# EAGLE design Small e-PaperShield v2.1 (EAGLE 7.2.0)
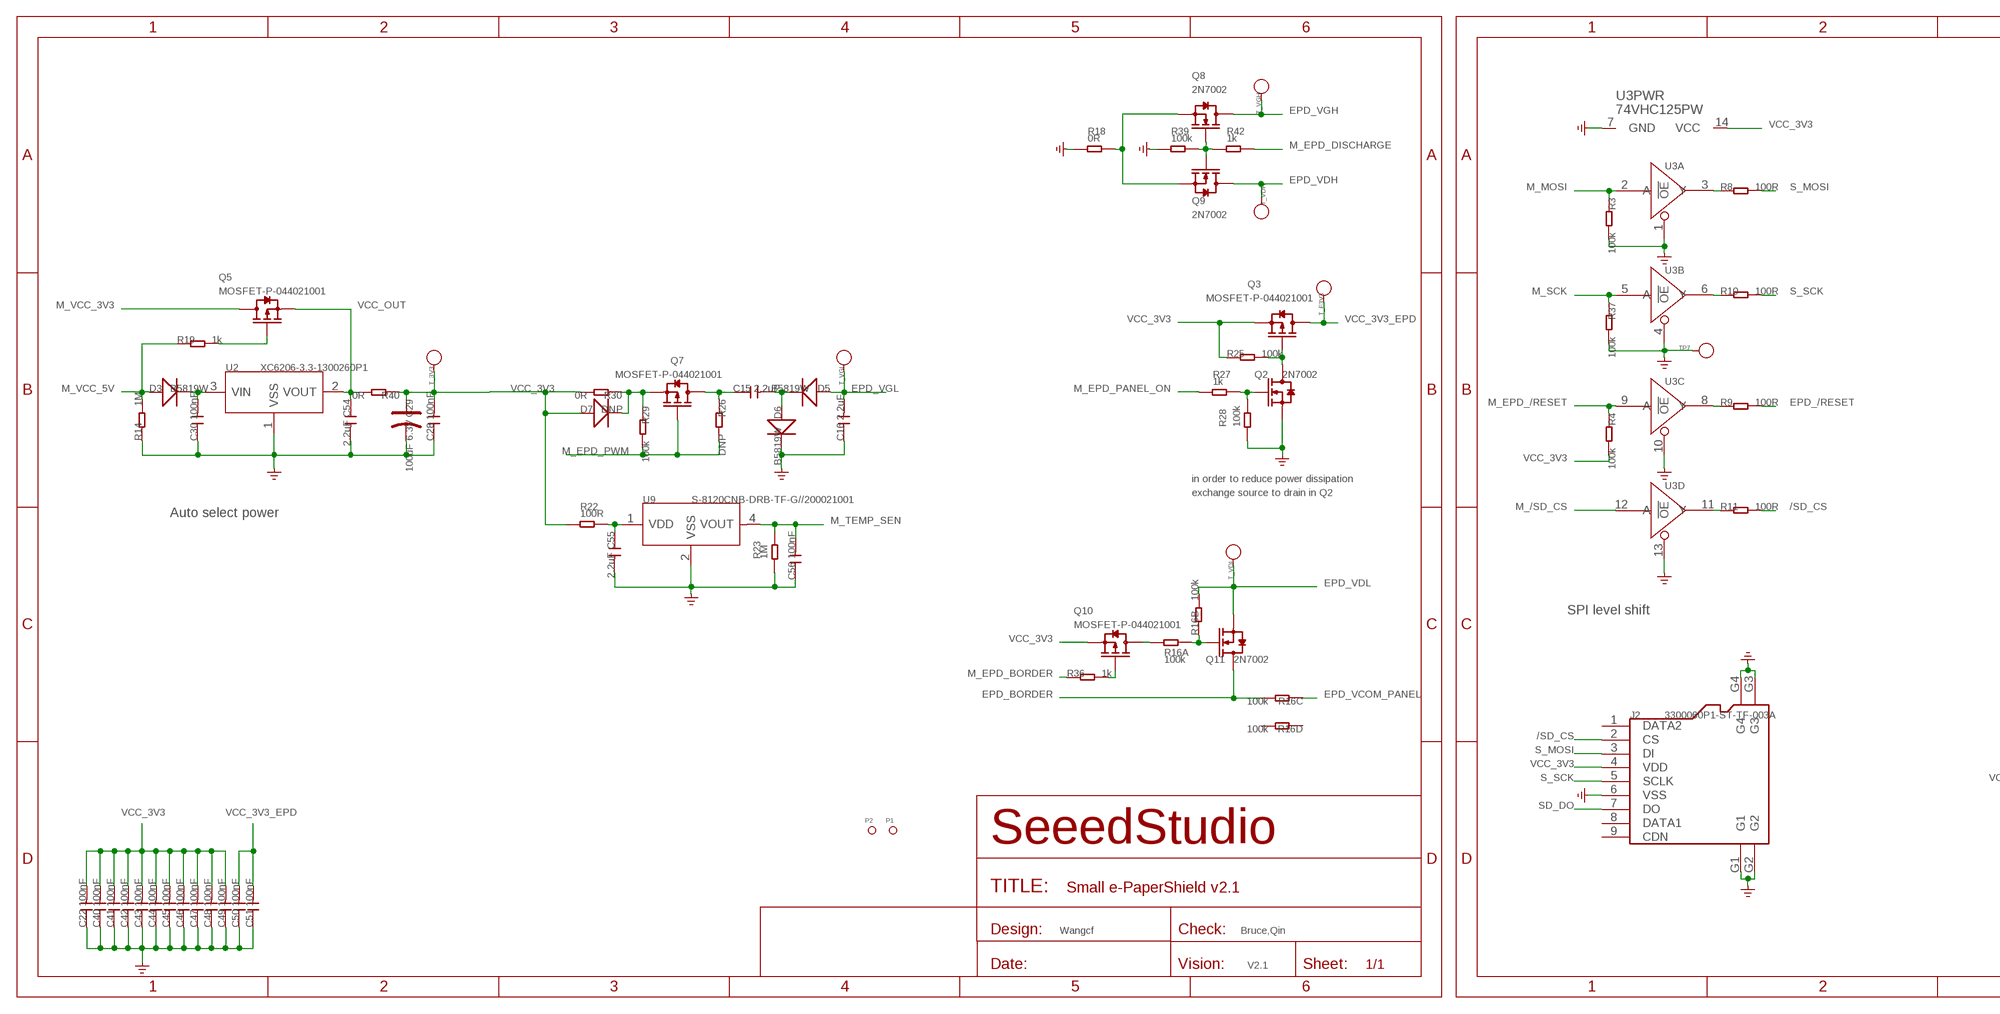
[diagram p0: schematic, sheet 1, part 1 of 2]
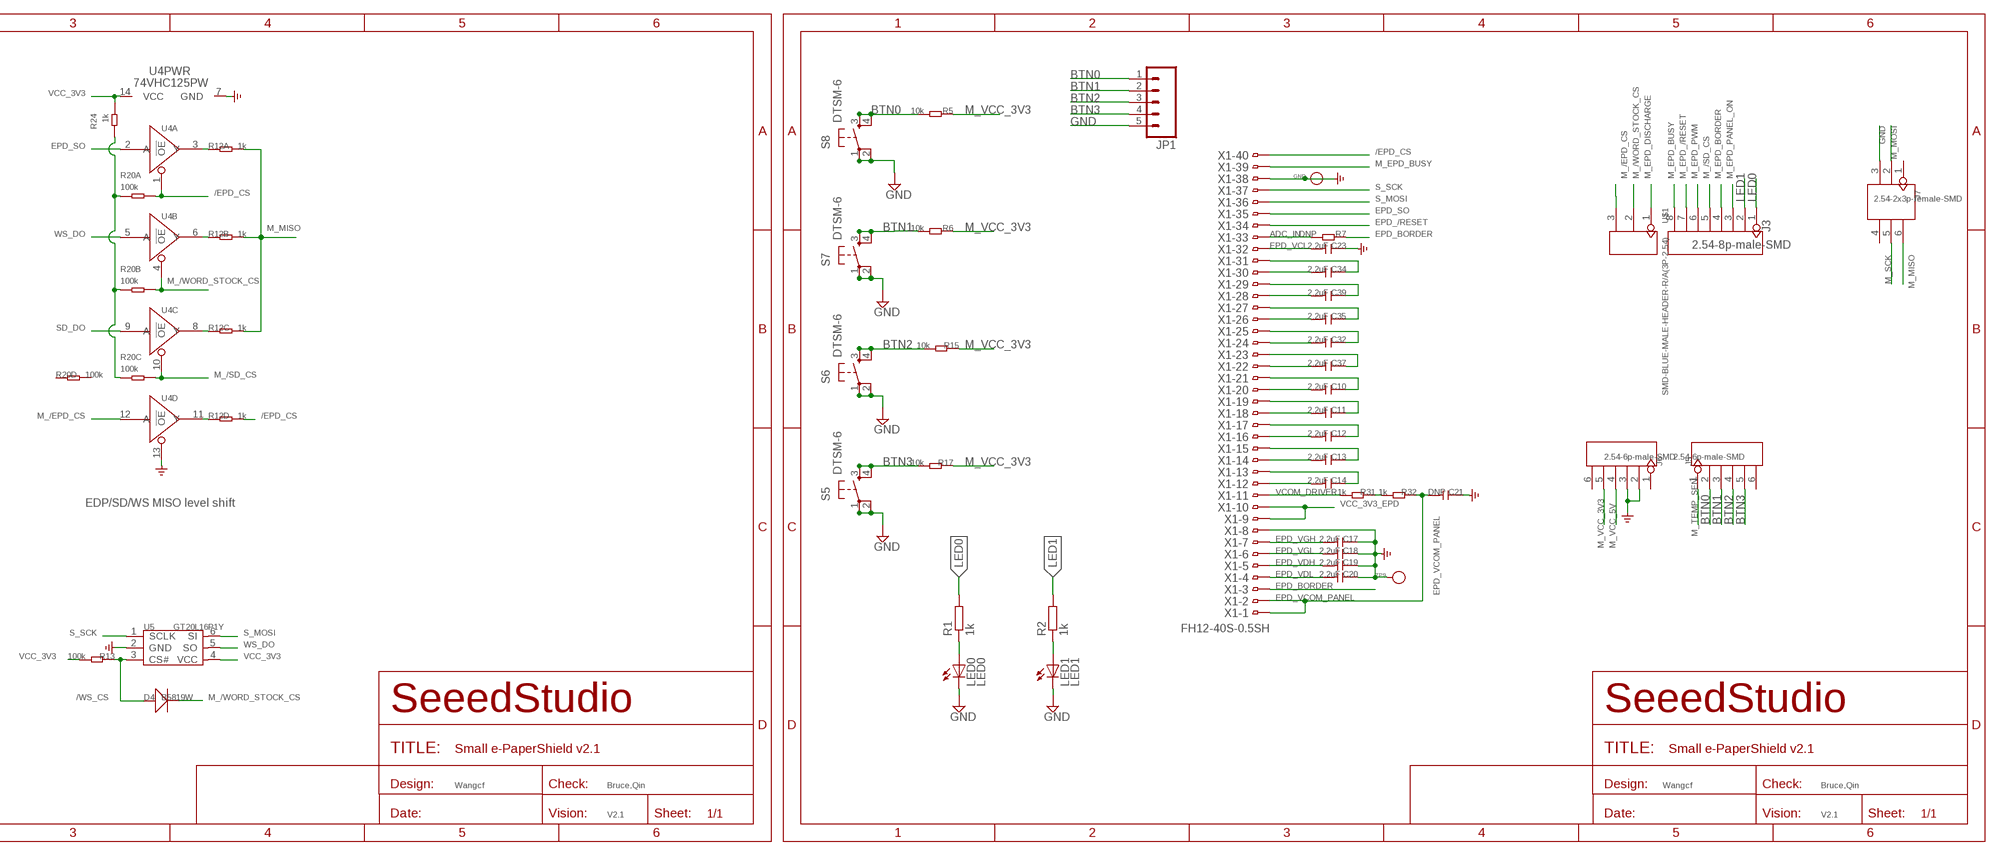
[diagram p1: schematic, sheet 1, part 2 of 2]

## Parts
C10  2.2uF  C-0805  [C0805]
C11  2.2uF  C-0805  [C0805]
C12  2.2uF  C-0805  [C0805]
C13  2.2uF  C-0805  [C0805]
C14  2.2uF  C-0805  [C0805]
C15  2.2uF  C-0805  [C0805]
C16  2.2uF  C-0805  [C0805]
C17  2.2uF  C-0805  [C0805]
C18  2.2uF  C-0805  [C0805]
C19  2.2uF  C-0805  [C0805]
C20  2.2uF  C-0805  [C0805]
C21  DNP  C-0805  [C0805]
C22  100nF  C-0603  [C0603]
C23  2.2uF  C-0805  [C0805]
C28  100nF  C-0603  [C0603]
C29  100uF 6.3V  CAP-AVX-B  [AVX-B]
C30  100nF  C-0603  [C0603]
C32  2.2uF  C-0805  [C0805]
C34  2.2uF  C-0805  [C0805]
C35  2.2uF  C-0805  [C0805]
C37  2.2uF  C-0805  [C0805]
C39  2.2uF  C-0805  [C0805]
C40  100nF  C-0603  [C0603]
C41  100nF  C-0603  [C0603]
C42  100nF  C-0603  [C0603]
C43  100nF  C-0603  [C0603]
C44  100nF  C-0603  [C0603]
C45  100nF  C-0603  [C0603]
C46  100nF  C-0603  [C0603]
C47  100nF  C-0603  [C0603]
C48  100nF  C-0603  [C0603]
C49  100nF  C-0603  [C0603]
C50  100nF  C-0603  [C0603]
C51  100nF  C-0603  [C0603]
C54  2.2uF  C-0805  [C0805]
C55  2.2uF  C-0805  [C0805]
C56  100nF  C-0603  [C0603]
D3  B5819W  D'1206'  [SOD123]
D4  B5819W  D'1206'  [SOD123]
D5  B5819W  D'1206'  [SOD123]
D6  B5819W  D'1206'  [SOD123]
D7  DNP  D'1206'  [SOD123]
GND  PAD-TEST-POINT'3535'  [TP_3535]
J2  3300060P1-ST-TF-003A  [9P-SMD-W/-RING]
J3  2.54-8p-male-SMD  HEADER-8P-2.54-SMD  [8P-2.54-SMD]
J5  2.54-6p-male-SMD  HEADER-6P-SMD  [6P-2.54-SMD]
J6  2.54-6p-male-SMD  HEADER-6P-SMD  [6P-2.54-SMD]
J7  2.54-2x3p-female-SMD  HEADER-2X3P-SMD  [2X3P-2.54-SMD]
JP1  M05PTH_LONGPADS  [1X05_LONGPADS]
LED0  LED0  LEDCHIPLED_0603  [CHIPLED_0603]
LED1  LED1  LEDCHIPLED_0603  [CHIPLED_0603]
P1  PAD-MARK  [ROUND-MARK-1.0]
P2  PAD-MARK  [ROUND-MARK-1.0]
Q2  2N7002  MOSFET-N'SOT23'  [SOT23]
Q3  MOSFET-P-044021001  [SOT23]
Q5  MOSFET-P-044021001  [SOT23]
Q7  MOSFET-P-044021001  [SOT23]
Q8  2N7002  MOSFET-N'SOT23'  [SOT23]
Q9  2N7002  MOSFET-N'SOT23'  [SOT23]
Q10  MOSFET-P-044021001  [SOT23]
Q11  2N7002  MOSFET-N'SOT23'  [SOT23]
R1  1k  R-EU_R0603  [R0603]
R2  1k  R-EU_R0603  [R0603]
R3  100k  R-0603  [R0603]
R4  100k  R-0603  [R0603]
R5  10k  R-0603  [R0603]
R6  10k  R-0603  [R0603]
R7  DNP  R-0603  [R0603]
R8  100R  R-0603  [R0603]
R9  100R  R-0603  [R0603]
R10  100R  R-0603  [R0603]
R11  100R  R-0603  [R0603]
R12  1k  R-4R-1206  [1206-8-3.3X2.4]
R13  100k  R-0603  [R0603]
R14  1M  R-0603  [R0603]
R15  10k  R-0603  [R0603]
R16  100k  R-4R-1206  [1206-8-3.3X2.4]
R17  10k  R-0603  [R0603]
R18  0R  R-0603  [R0603]
R19  1k  R-0603  [R0603]
R20  100k  R-4R-1206  [1206-8-3.3X2.4]
R22  100R  R-0603  [R0603]
R23  1M  R-0603  [R0603]
R24  1k  R-0603  [R0603]
R25  100k  R-0603  [R0603]
R26  DNP  R-0603  [R0603]
R27  1k  R-0603  [R0603]
R28  100k  R-0603  [R0603]
R29  100k  R-0603  [R0603]
R30  0R  R-0603  [R0603]
R31  1k  R-0603  [R0603]
R32  1k  R-0603  [R0603]
R36  1k  R-0603  [R0603]
R37  100k  R-0603  [R0603]
R39  100k  R-0603  [R0603]
R40  0R  R-0603  [R0603]
R42  1k  R-0603  [R0603]
S5  DTSM-6  [DTSM-6]
S6  DTSM-6  [DTSM-6]
S7  DTSM-6  [DTSM-6]
S8  DTSM-6  [DTSM-6]
T_3V3  PAD-TEST-POINT'3535'  [TP_3535]
T_E3V3  PAD-TEST-POINT'3535'  [TP_3535]
T_VDH  PAD-TEST-POINT'3535'  [TP_3535]
T_VDL  PAD-TEST-POINT'3535'  [TP_3535]
T_VGH  PAD-TEST-POINT'3535'  [TP_3535]
T_VGL  PAD-TEST-POINT'3535'  [TP_3535]
TP7  PAD-TEST-POINT'3535'  [TP_3535]
TP9  PAD-TEST-POINT'3535'  [TP_3535]
U2  XC6206-3.3-1300260P1  [SOT23]
U3  74VHC125PW  [TSSOP14]
U4  74VHC125PW  [TSSOP14]
U5  GT20L16P1Y  [SOT23-6]
U9  S-8120CNB-DRB-TF-G//200021001  S-8110C/8120C  [SC-82AB]
U$1  SMD-BLUE-MALE-HEADER-R/A(3P-2.54)  [H3-SMD-2.54]
X1  FH12-40S-0.5SH  [FH12-40S-0.5SH]

## Nets
3V3_LOG: R20.1 R20.2 R20.3 R24.2
/EPD_CS: R12.5 R20.8 U4.1(A:!OE) X1.40
/SD_CS: J2.2(CS) R11.2
/WS_CS: D4.+ R13.1 U5.3(CS#)
ADC_IN: R7.2 X1.33
BTN0: J5.2 JP1.1 R5.2 S8.3 S8.4
BTN1: J5.3 JP1.2 R6.2 S7.3 S7.4
BTN2: J5.4 JP1.3 R15.2 S6.3 S6.4
BTN3: J5.5 JP1.4 R17.2 S5.3 S5.4
EPD_/RESET: R9.2 X1.34
EPD_BORDER: Q11.3(D) R7.1 R16.6 X1.3
EPD_SO: U4.2(A:A) X1.35
EPD_VCL: C23.2 X1.32
EPD_VCOM_PANEL: C21.2 R16.3 R32.1 X1.1 X1.2
EPD_VDH: C19.2 Q9.3(D) T_VDH.T X1.5
EPD_VDL: C20.2 Q11.2(S) R16.7 T_VDL.T X1.4
EPD_VGH: C17.2 Q8.3(D) T_VGH.T X1.7
EPD_VGL: C16.2 C18.2 D5.+ T_VGL.T X1.6
GND: C16.1 C17.1 C18.1 C19.1 C20.1 C21.1 C22.1 C23.1 C28.1 C29.- C30.1 C40.1 C41.1 C42.1 C43.1 C44.1 C45.1 C46.1 C47.1 C48.1 C49.1 C50.1 C51.1 C54.2 C55.2 C56.1 D6.- GND.T J2.6(VSS) J2.G1 J2.G2 J2.G3 J2.G4 J6.2 J6.3 J7.3 JP1.5 LED0.C LED1.C Q2.2(S) R3.2 R14.1 R18.1 R23.1 R28.1 R37.2 R39.1 S5.1 S5.2 S6.1 S6.2 S7.1 S7.2 S8.1 S8.2 TP7.T TP9.T U2.1(VSS) U3.1(A:!OE) U3.4(B:!OE) U3.7(PWR:GND) U3.10(C:!OE) U3.13(D:!OE) U4.7(PWR:GND) U4.13(D:!OE) U5.2(GND) U9.2(VSS) X1.8 X1.38
LED0: J3.1 R1.2
LED1: J3.2 R2.2
M_/EPD_CS: U4.12(D:A) U$1.3
M_/SD_CS: J3.5 R20.6 U3.12(D:A) U4.10(C:!OE)
M_/WORD_STOCK_CS: D4.- R20.7 U4.4(B:!OE) U$1.2
M_EPD_/RESET: J3.7 R4.1 U3.9(C:A)
M_EPD_BORDER: J3.4 R36.1
M_EPD_BUSY: J3.8 X1.39
M_EPD_DISCHARGE: R42.2 U$1.1
M_EPD_PANEL_ON: J3.3 R27.1
M_EPD_PWM: J3.6 Q7.1(G) R26.2 R29.2
M_MISO: J7.6 R12.6 R12.7 R12.8
M_MOSI: J7.2 R3.1 U3.2(A:A)
M_SCK: J7.5 R37.1 U3.5(B:A)
M_TEMP_SEN: C56.2 J5.1 R23.2 U9.4(VOUT)
M_VCC_3V3: J6.5 Q5.3(D) R5.1 R6.1 R15.1 R17.1
M_VCC_5V: D3.+ J6.4 R14.2 R19.1
N$1: LED0.A R1.1
N$2: Q5.1(G) R19.2
N$3: C15.2 D5.- D6.+
N$4: D7.- Q7.2(S) R29.1 R30.1
N$6: Q2.1(G) R27.2 R28.2
N$7: R11.1 U3.11(D:Y)
N$8: C30.2 D3.- U2.3(VIN)
N$9: C15.1 Q7.3(D) R26.1
N$10: Q8.1(G) Q9.1(G) R39.2 R42.1
N$11: Q2.3(D) Q3.1(G) R25.2
N$12: R31.1 R32.2
N$13: Q10.3(D) R16.1
N$14: Q10.1(G) R36.2
N$16: Q8.2(S) Q9.2(S) R18.2
N$17: LED1.A R2.1
N$20: R12.1 U4.3(A:Y)
N$21: R12.2 U4.6(B:Y)
N$22: R12.3 U4.8(C:Y)
N$27: R12.4 U4.11(D:Y)
N$28: Q11.1(G) R16.2 R16.8
N$34: C34.1 X1.31
N$35: C34.2 X1.30
N$36: C39.1 X1.29
N$37: C39.2 X1.28
N$74: R8.1 U3.3(A:Y)
N$76: R10.1 U3.6(B:Y)
N$80: R9.1 U3.8(C:Y)
N$81: C35.1 X1.27
N$85: C35.2 X1.26
N$88: C32.1 X1.25
N$89: C32.2 X1.24
N$90: C37.1 X1.23
N$91: C37.2 X1.22
N$92: C10.1 X1.21
N$93: C10.2 X1.20
N$94: C11.1 X1.19
N$95: C11.2 X1.18
N$96: C12.1 X1.17
N$97: C12.2 X1.16
N$98: C13.1 X1.15
N$99: C13.2 X1.14
N$100: C14.1 X1.13
N$101: C14.2 X1.12
S_MOSI: J2.3(DI) R8.2 U5.6(SI) X1.36
S_SCK: J2.5(SCLK) R10.2 U5.1(SCLK) X1.37
SD_DO: J2.7(DO) U4.9(C:A)
VCC_3V3: C22.2 C28.2 C29.+ C40.2 C41.2 C42.2 C43.2 C44.2 C45.2 C46.2 C47.2 C48.2 C49.2 D7.+ J2.4(VDD) Q3.2(S) Q10.2(S) R4.2 R13.2 R22.1 R24.1 R25.1 R30.2 R40.1 T_3V3.T U3.14(PWR:VCC) U4.14(PWR:VCC) U5.4(VCC)
VCC_3V3_EPD: C50.2 C51.2 Q3.3(D) T_E3V3.T X1.9 X1.10
VCC_OUT: C54.1 Q5.2(S) R40.2 U2.2(VOUT)
VCOM_DRIVER: R31.2 X1.11
VDD: C55.1 R22.2 U9.1(VDD)
WS_DO: U4.5(B:A) U5.5(SO)
Unconnected: J2.1(DATA2) J2.8(DATA1) J2.9(CDN) J5.6 J6.1 J6.6 J7.1 J7.4 R16.4 R16.5 R20.4 R20.5

## Notes on the sheet
- in order to reduce power dissipation
- exchange source to drain in Q2
- Auto select power
- EDP/SD/WS MISO level shift
- SPI level shift
- Wangcf | Bruce,Qin | Wangcf | Bruce,Qin | Wangcf | Bruce,Qin
- V2.1 | V2.1 | V2.1

## Library data of the parts
C10-C23 C28 C30 C32 C34 C35 C37 C39-C51 C54-C56 = Discrete:C*: Ceramic Capacitors
C29 = Discrete:CAP*: Electrolytic Capacitors,Tantalum Capacitors and Super Capacitors
D3-D7 = Discrete:D*
GND T_3V3 T_E3V3 T_VDH T_VDL T_VGH T_VGL TP7 TP9 = Discrete:PAD-TEST-POINT; PARTNO: DNP
J2 = OPL-NEW:3300060P1-ST-TF-003A: Micro SD Card
J3 = Connector:HEADER-8P
J5 J6 = Connector:HEADER-6P
J7 = Connector:HEADER-2X3P
JP1 = SparkFun-Connectors:M05: Header 5 Standard 5-pin 0.1" header. Use with straight break away headers (SKU : PRT-00116), right angle break away headers (PRT-00553), swiss pins (PRT-00743), machine pins (PRT-00117), and female headers (PRT-00115). Molex polarized connector foot print use with SKU : PRT-08230 with associated crimp pins and housings.
LED0 LED1 = adafruit:LED: LED OSRAM: - CHIPLED LG R971, LG N971, LY N971, LG Q971, LY Q971, LO R971, LY R971 LH N974, LH R974 LS Q976, LO Q976, LY Q976 LO Q996 - Hyper CHIPLED LW Q18S LB Q993, LB Q99A, LB R99A - SideLED LS A670, LO A670, LY A670, LG A670, LP A670 LB A673, LV A673, LT A673, LW A673 LH A674 LY A675 LS A676, LA A676, LO A676, LY A676, LW A676 LS A679, LY A679, LG A679 - Hyper Micro SIDELED® LS Y876, LA Y876, LO Y876, LY Y876 LT Y87S - SmartLED LW L88C, LW L88S LB L89C, LB L89S, LG L890 LS L89K, LO L89K, LY L89K LS L896, LA L896, LO L896, LY L896 - TOPLED LS T670, LO T670, LY T670, LG T670, LP T670 LSG T670, LSP T670, LSY T670, LOP T670, LYG T670 LG T671, LOG T671, LSG T671 LB T673, LV T673, LT T673, LW T673 LH T674 LS T676, LA T676, LO T676, LY T676, LB T676, LH T676, LSB T676, LW T676 LB T67C, LV T67C, LT T67C, LS T67K, LO T67K, LY T67K, LW E67C LS E67B, LA E67B, LO E67B, LY E67B, LB E67C, LV E67C, LT E67C LW T67C LS T679, LY T679, LG T679 LS T770, LO T770, LY T770, LG T770, LP T770 LB T773, LV T773, LT T773, LW T773 LH T774 LS E675, LA E675, LY E675, LS T675 LS T776, LA T776, LO T776, LY T776, LB T776 LHGB T686 LT T68C, LB T68C - Hyper Mini TOPLED® LB M676 - Mini TOPLED Santana® LG M470 LS M47K, LO M47K, LY M47K Source: http://www.osram.convergy.de/
P1 P2 = Discrete:PAD-MARK; PARTNO: DNP
Q2 Q8 Q9 Q11 = Discrete:MOSFET-N: IRLL014: http://www.vishay.com/docs/91319/sihll014.pdf
Q3 Q5 Q7 Q10 = OPL:MOSFET-P: CJ2305：SMD MOSFET P-CH 8V-4.1A
R1 R2 = rcl:R-EU_: RESISTOR, European symbol
R3-R11 R13-R15 R17-R19 R22-R32 R36 R37 R39 R40 R42 = Discrete:R*
R12 R16 R20 = Discrete:R-4R*: Resistor Array
S5-S8 = switch-tact:DTSM-6
U2 = OPL:XC6206-3.3: LOW ESR Cap.Compatible Positive Voltage Regulators
U3 U4 = IC:74V*125: Quad Buffer/Line Driver;3-state
U5 = template:GT20L16P1Y
U9 = template:S-8110C/8120C: COMS Temperature Sensor IC
U$1 = Seeed-OPL-Connector:SMD-BLUE-MALE-HEADER-R/A(3P-2.54)
X1 = con-hirose:FH12-40S-0.5S: 0.5mm Pitch Connectors For FPC/FFC Source: Data sheet <http://www.hirose.co.jp/cataloge_hp/e58605370.pdf>; MPN: FH12-40S-0.5SH(55); OC_FARNELL: 1324556; OC_NEWARK: 34M6178

## Net classes
0 default: width 0.203 mm, drill 0.305 mm, clearance 0.152 mm
1 power: width 0.305 mm, drill 0.305 mm, clearance 0.152 mm

## Board
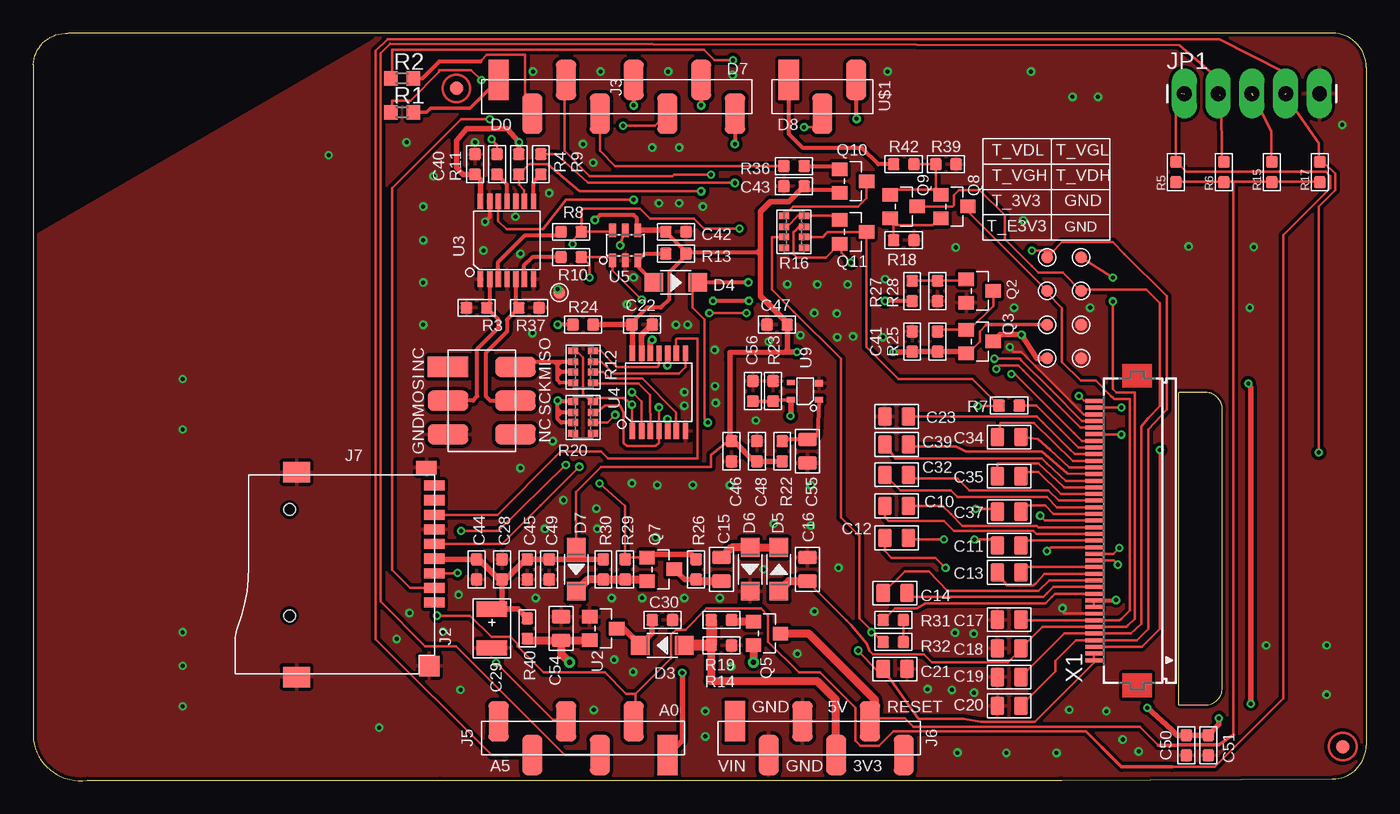
[diagram p2: board, top side]
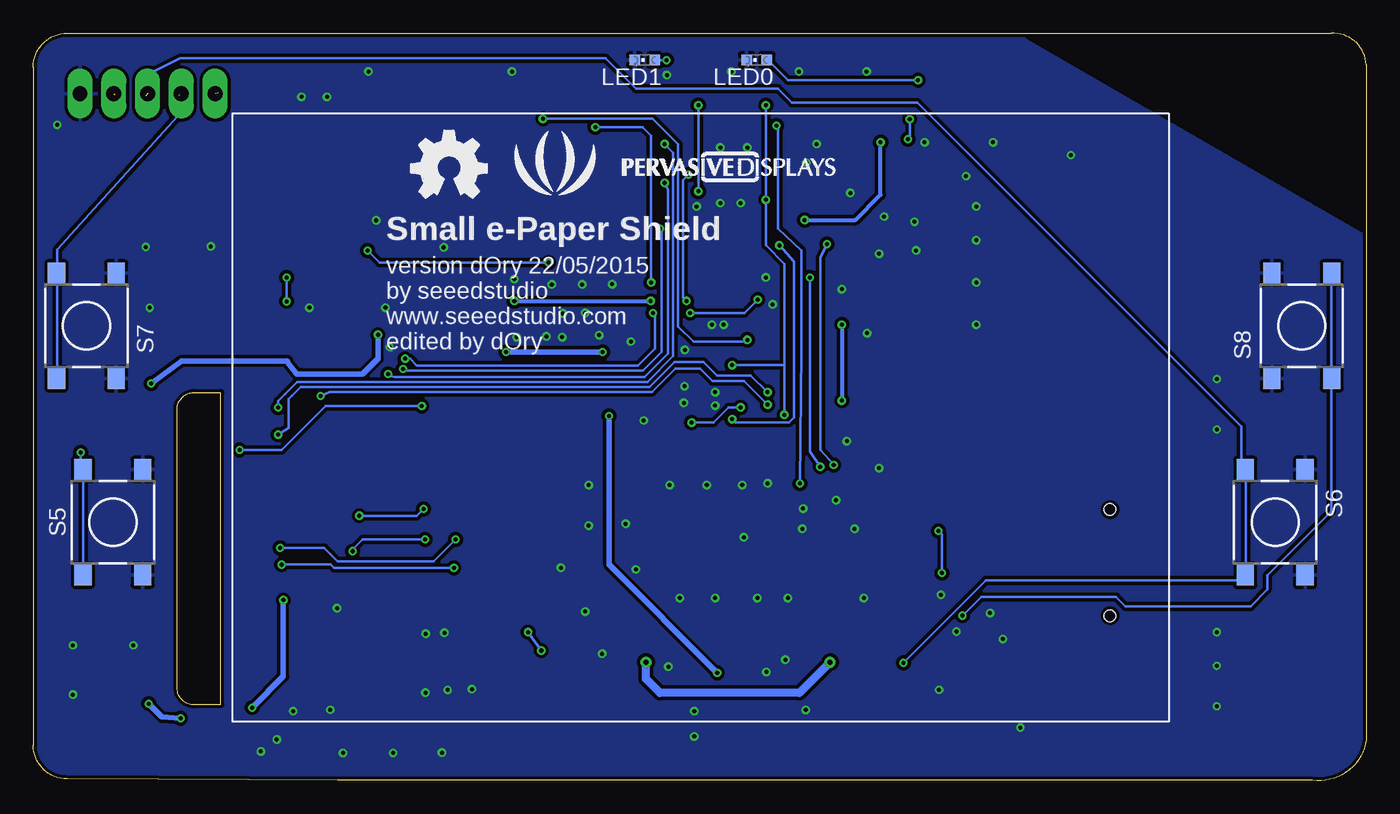
[diagram p3: board, bottom side, seen from below]

Size 100.28 x 56.24 mm. Coordinates in mm from the lower left corner, seen from the top.
Outline: 77.19,0.03 30.57,0.03 4.06,0.03 arc-90 0,3.08 0,53.86 arc-90 2.62,56.24 97.74,56.24 arc-90 100.28,53.7 100.28,2.67 arc-90 97.74,0.13 77.19,0.03
Outline: 77.19,0.03 77.4,0.03
Outline: 86.16,5.71 86.16,29.21 88.2,29.21 arc-90 89.45,27.93 89.45,6.97 arc-90 88.19,5.7 86.16,5.71
Copper layers (1*16): Top 0.035mm / dielectric 1.5mm / Bottom 0.035mm
Design rules "SeeedStudio_rule_no_angle_090911 *": minimum track width 6mil, minimum drill 12mil, track to track 6mil, track to pad 6mil, pad to pad 6mil, via to via 6mil, smd to smd 0mil, copper to edge 10mil, drill to drill 10mil, minimum pad ring 10mil, minimum via ring 6mil, stop-mask expansion 2mil, vias tented up to drill 100mil, thermal gap 10mil
tRestrict: area -3.4,39.7 to 25.2,56.3
bRestrict: area -3.4,39.7 to 25.2,56.3

### Footprints (pad centres in the part's own frame; a part is rotated, then mirrored left to right if it is on the bottom)
C0805 = smd 1.016 x 1.397: 1 -0.889,0; 2 0.889,0
C0603 = smd 0.889 x 0.889: 1 -0.762,0; 2 0.762,0
AVX-B = smd 1.143 x 2.286: + -1.46,0; - 1.46,0
SOD123 = smd 1.397 x 1.397: + -1.651,0; - 1.651,0
TP_3535 = smd 0.889 x 0.889: T 0,0
9P-SMD-W/-RING = smd 1.524 x 0.762: 1 0,4.4; 2 0,3.3; 3 0,2.2; 4 0,1.1; 5 0,0; 6 0,-1.1; 7 0,-2.2; 8 0,-3.3; 9 0,-4.4 | smd 1.524 x 1.016: G1 0.6,-5.746 | smd 2.032 x 1.524: G2 10.373,-5.4; G3 10.373,10 | smd 1.524 x 1.524: G4 0.392,9.181 | hole 0.889: 10.9,-2.6; 10.9,5.4
8P-2.54-SMD = smd 3.048 x 1.524: 1 1.27,8.89; 2 -1.27,6.35; 3 1.27,3.81; 4 -1.27,1.27; 5 1.27,-1.27; 6 -1.27,-3.81; 7 1.27,-6.35; 8 -1.27,-8.89
6P-2.54-SMD = smd 3.048 x 1.524: 1 1.27,6.35; 2 -1.27,3.81; 3 1.27,1.27; 4 -1.27,-1.27; 5 1.27,-3.81; 6 -1.27,-6.35
2X3P-2.54-SMD = smd 3.048 x 1.524: 1 -2.54,2.54; 2 -2.54,0; 3 -2.54,-2.54; 4 2.54,-2.54; 5 2.54,0; 6 2.54,2.54
1X05_LONGPADS = drill 1.118 pad 1.88 long: 1 0,0; 2 2.54,0; 3 5.08,0; 4 7.62,0; 5 10.16,0
CHIPLED_0603 = smd 0.8 x 0.8: A 0,-0.75; C 0,0.75
ROUND-MARK-1.0 = smd 1.016 x 1.016: P$1 0,0
SOT23 = smd 1.016 x 1.143: 1 -0.889,-1.016; 2 0.889,-1.016; 3 0,1.016
R0603 = smd 1 x 1.1: 1 -0.85,0; 2 0.85,0
R0603' = smd 0.889 x 0.889: 1 -0.762,0; 2 0.762,0
1206-8-3.3X2.4 = smd 0.508 x 0.762: 1 -1.206,-0.762; 2 -0.381,-0.762; 3 0.381,-0.762; 4 1.206,-0.762; 5 1.206,0.762; 6 0.381,0.762; 7 -0.381,0.762; 8 -1.206,0.762
DTSM-6 = smd 1.55 x 1.3: 1 -3.975,2.25; 2 3.975,2.25; 3 -3.975,-2.25; 4 3.975,-2.25
TSSOP14 = smd 0.4 x 1.2: 1 -2,-2.925; 2 -1.3,-2.925; 3 -0.65,-2.925; 4 0,-2.925; 5 0.65,-2.925; 6 1.3,-2.925; 7 2,-2.925; 8 2,2.925; 9 1.3,2.925; 10 0.65,2.925; 11 0,2.925; 12 -0.65,2.925; 13 -1.3,2.925; 14 -2,2.925
SOT23-6 = smd 0.508 x 1.016: 1 -0.95,-1.143; 2 0,-1.143; 3 0.95,-1.143; 4 0.95,1.143; 5 0,1.143; 6 -0.95,1.143
SC-82AB = smd 0.4 x 0.6: 1 -0.65,-1.05; 3 0.65,1.05; 4 -0.65,1.05 | smd 0.5 x 0.6: 2 0.6,-1.05
H3-SMD-2.54 = smd 3.048 x 1.524: 1 1.27,6.35; 2 -1.27,3.81; 3 1.27,1.27
FH12-40S-0.5SH = smd 0.3 x 1.3: 1 -9.75,3.25; 2 -9.25,3.25; 3 -8.75,3.25; 4 -8.25,3.25; 5 -7.75,3.25; 6 -7.25,3.25; 7 -6.75,3.25; 8 -6.25,3.25; 9 -5.75,3.25; 10 -5.25,3.25; 11 -4.75,3.25; 12 -4.25,3.25; 13 -3.75,3.25; 14 -3.25,3.25; 15 -2.75,3.25; 16 -2.25,3.25; 17 -1.75,3.25; 18 -1.25,3.25; 19 -0.75,3.25; 20 -0.25,3.25; 21 0.25,3.25; 22 0.75,3.25; 23 1.25,3.25; 24 1.75,3.25; 25 2.25,3.25; 26 2.75,3.25; 27 3.25,3.25; 28 3.75,3.25; 29 4.25,3.25; 30 4.75,3.25; 31 5.25,3.25; 32 5.75,3.25; 33 6.25,3.25; 34 6.75,3.25; 35 7.25,3.25; 36 7.75,3.25; 37 8.25,3.25; 38 8.75,3.25; 39 9.25,3.25; 40 9.75,3.25

### Placement (x,y rotation side)
C10  64.95,20.67 180 top
C11  73.41,17.7 180 top
C12  64.95,18.26 180 top
C13  73.41,15.67 180 top
C14  64.83,14.12 0 top
C15  51.77,15.9 90 top
C16  58.25,15.9 270 top
C17  73.41,12.11 0 top
C18  73.41,9.95 0 top
C19  73.41,7.8 0 top
C20  73.41,5.64 0 top
C21  64.83,8.41 180 top
C22  45.8,34.31 180 top
C23  64.95,27.4 0 top
C28  35.26,15.9 270 top
C29  34.5,11.45 270 top
C30  47.33,12.09 180 top
C32  64.95,23.01 180 top
C34  73.41,25.85 0 top
C35  73.41,22.91 0 top
C37  73.41,20.24 180 top
C39  64.95,25.3 180 top
C40  33.23,46.38 270 top
C41  66.12,33.04 270 top
C42  48.34,41.3 180 top
C43  57.23,44.73 0 top
C44  33.36,15.9 90 top
C45  37.17,15.9 90 top
C46  52.53,24.79 90 top
C47  55.96,34.31 0 top
C48  54.44,24.79 270 top
C49  38.82,15.9 90 top
C50  86.75,2.66 90 top
C51  88.4,2.66 90 top
C54  39.71,11.45 90 top
C55  58.25,24.79 270 top
C56  54.13,29.31 270 top
D3  47.33,10.18 180 top
D4  48.34,37.49 0 top
D5  56.09,15.9 90 top
D6  53.93,15.9 270 top
D7  40.85,15.9 270 top
GND  78.82,31.77 0 top
J2  30.18,17.8 180 top
J3  43.9,51.46 90 top
J5  41.36,3.2 270 top
J6  59.14,3.2 90 top
J7  33.74,28.6 0 top
JP1  86.6,51.69 0 top
LED0  45.86,54.23 90 bottom
LED1  54.28,54.22 90 bottom
P1  31.83,52.09 0 top
P2  98.51,2.56 0 top
Q2  71.2,36.85 270 top
Q3  71.2,33.04 270 top
Q5  55.2,11.07 270 top
Q7  47.2,15.9 270 top
Q8  69.3,43.2 270 top
Q9  65.49,43.2 270 top
Q10  61.68,45.11 270 top
Q11  61.68,41.3 270 top
R1  27.74,50.29 0 top
R2  27.74,52.83 0 top
R3  100k  [R0603']  33.36,35.58 180 top
R4  100k  [R0603']  36.53,46.38 90 top
R5  10k  [R0603']  85.96,45.79 90 top
R6  10k  [R0603']  89.57,45.79 90 top
R7  DNP  [R0603']  73.41,28.22 0 top
R8  100R  [R0603']  40.47,41.3 0 top
R9  100R  [R0603']  38.18,46.38 90 top
R10  100R  [R0603']  40.47,39.39 0 top
R11  100R  [R0603']  34.88,46.38 90 top
R12  41.36,31.14 90 top
R13  100k  [R0603']  48.34,39.65 0 top
R14  1M  [R0603']  51.77,10.18 180 top
R15  10k  [R0603']  93.17,45.79 90 top
R16  57.23,41.3 270 top
R17  10k  [R0603']  96.78,45.79 90 top
R18  0R  [R0603']  65.49,40.66 180 top
R19  1k  [R0603']  51.77,12.09 0 top
R20  41.36,27.33 270 top
R22  100R  [R0603']  56.34,24.79 90 top
R23  1M  [R0603']  55.66,29.31 270 top
R24  1k  [R0603']  41.36,34.31 180 top
R25  100k  [R0603']  68.03,33.04 90 top
R26  DNP  [R0603']  49.87,15.9 90 top
R27  1k  [R0603']  66.12,36.85 90 top
R28  100k  [R0603']  68.03,36.85 90 top
R29  100k  [R0603']  44.53,15.9 90 top
R30  0R  [R0603']  42.88,15.9 90 top
R31  1k  [R0603']  64.7,12.09 180 top
R32  1k  [R0603']  64.7,10.44 0 top
R36  1k  [R0603']  57.23,46.25 0 top
R37  100k  [R0603']  37.29,35.58 0 top
R39  100k  [R0603']  68.66,46.38 180 top
R40  0R  [R0603']  37.17,11.45 270 top
R42  1k  [R0603']  65.49,46.38 180 top
S5  94.29,19.44 270 bottom
S6  6.85,19.44 270 bottom
S7  96.29,34.22 270 bottom
S8  4.85,34.23 90 bottom
T_3V3  76.28,34.31 90 top
T_E3V3  76.28,31.77 270 top
T_VDH  78.82,36.85 270 top
T_VDL  76.28,39.39 180 top
T_VGH  76.28,36.85 270 top
T_VGL  78.82,39.39 90 top
TP7  39.58,36.73 0 top
TP9  78.82,34.31 0 top
U2  42.88,11.45 270 top
U3  35.64,40.66 0 top
U4  47.07,29.23 0 top
U5  44.53,40.28 0 top
U9  58.07,29.31 90 top
U$1  63.18,51.46 90 top
U$20  [LOGO_SILK]  61.04,45.74 0 bottom
U$47  [OSHW_FILLX200_NOTEXT]  71.84,43.84 0 bottom
X1  83.04,18.82 90 top

### Tracks (layer width: path | path; a pad name or v marks a point on that pad's centre or on a via)
3V3_LOG  (via drill 0.3 pad 0.64)
  Top 0.305: R24.2 v39.45,34.31 | R20.1 39.5,28.55 v39.45,28.6 39.45,28.34 | R20.3 39.71,26.95 39.45,27.2 39.45,27.45 | 39.45,27.45 39.45,27.71 | 39.45,27.71 39.45,27.96 | 39.45,27.96 39.45,28.34 | R20.2 39.71,27.71 | 39.71,27.71 39.45,27.71 | 39.45,27.45 39.71,27.71 | 39.71,27.71 39.45,27.96 | 39.45,28.34 39.58,28.47
  Bottom 0.305: v39.45,34.31 v39.45,28.6
/EPD_CS  (via drill 0.3, 0.3 pad 0.64)
  Top 0.203: R12.5 40.85,32.36 41.36,31.85 41.36,29.11 41.99,28.47 42.04,28.47 R20.8 42.39,28.8 44.41,28.8 v45.04,28.29 45.04,26.34 U4.1 | v78.67,28.95 79.05,28.6 X1.40
  Bottom 0.203: v45.04,28.29 46.82,30.07 49.18,30.07 50.12,31.01 51.95,31.01 53.73,29.23 75.9,29.23 77.98,29.23 v78.67,28.95
/SD_CS  (via drill 0.3)
  Top 0.203: R11.2 34.88,47.75 | 34.88,47.75 34.88,47.85 v34.48,48.26 34.48,48.16 34.88,47.75 | J2.2 28.35,14.5 26.98,15.87 26.98,44.57 32.19,49.78 v34.35,49.78
  Bottom 0.203: v34.35,49.78 34.35,48.38 v34.48,48.26
/WS_CS
  Top 0.305: R13.1 45.98,39.65 U5.3 45.47,38.71 D4.+
ADC_IN
  Top 0.203: R7.2 75.47,28.22 77.27,26.41 78.62,25.07 X1.33
BTN0  (via drill 0.3)  (1 unrouted)
  Top 0.203: 86.38,51.73 85.96,51.56 R5.2 86.04,46.56 86.75,45.84 97.24,45.84 97.59,45.49 97.59,44.6 94.04,41.04 94.04,6.2 88.88,1.04 85.68,1.04 | 45.32,6.55 45.32,4.59 J5.2 | 45.32,6.55 47.99,9.22 47.99,11 48.34,11.35 49.05,11.35 50.66,12.95 54.74,12.95 55.28,12.42 55.28,10.46 57.59,8.15 59.19,8.15 61.86,5.48 61.86,2.99 62.21,2.64 63.63,2.64 64.7,3.71 79.19,3.71 80.4,2.51 | v30.39,12.42 32.88,12.42 34.48,10.82 35.9,10.82 36.43,10.28 36.43,10.11 38.39,8.15 43.01,8.15 44.61,6.55 45.32,6.55
  Top 0.21: 79.19,3.71 80.4,2.51 80.4,2.49
  Top 0.254: 85.68,1.04 81.86,1.04 80.4,2.49
  Bottom 0.203: S8.4 2.65,38.2 2.65,30.38 S8.3 2.65,30.2 2.65,20.24 7.45,15.44 7.45,14.37 8.69,13.13 18.12,13.13 18.83,13.84 28.96,13.84 v30.39,12.42
BTN1  (1 unrouted)
  Top 0.203: 89.37,51.53 89.42,46.29 89.42,46.56 R6.2 | 89.07,52.91 86.24,55.35 26.83,55.45 26.12,54.73 26.12,13.48 29.5,10.11 31.81,10.11 39.99,1.93 42.48,1.93 J5.3
  Top 0.21: 89.07,52.91 89.07,51.77 JP1.2 89.3,51.53 89.37,51.53
  Bottom 0.203: S7.4 98.48,30.38 98.48,38.2 S7.3 98.48,38.38 98.48,39.98 89.07,50.39 89.27,51.63
BTN2  (via drill 0.3)  (2 unrouted)
  Top 0.203: 91.78,51.53 93.15,48.87 93.15,46.56 R15.2 | v34.83,8.86 39.1,4.59 39.99,4.59 J5.4
  Bottom 0.203: v34.83,8.86 28.61,15.09 9.58,15.09 9.23,15.44 S6.4 9.05,15.62 9.05,23.26 S6.3 9.23,23.44 9.41,23.62 9.41,26.64 33.76,51 43.19,51 44.25,52.07 54.92,52.07 57.23,54.38 89.24,54.38 91.48,53.23 91.68,51.71
BTN3  (via drill 0.3)  (1 unrouted)
  Top 0.203: 94.15,51.63 96.7,47.98 96.7,46.56 R17.2 96.88,46.56 97.06,46.56 97.95,45.67 97.95,44.42 96.7,43.18 v96.7,24.69 | 94.13,53.31 89.24,55.8 26.65,55.8 25.76,54.91 25.76,10.64 34.48,1.93 37.5,1.93 J5.5
  Top 0.21: 94.13,53.31 94.13,51.79 JP1.4
  Bottom 0.203: S5.4 96.53,15.62 96.53,23.26 S5.3 96.7,23.44 v96.7,24.69
EPD_/RESET  (via drill 0.3, 0.3 pad 0.64)
  Top 0.203: R9.2 39.33,47.14 41.74,44.98 v52.79,44.98 | X1.34 78.88,25.57 78.29,26.16 73.84,30.6 v73.59,30.6
  Bottom 0.203: v52.79,44.98 52.53,44.47 52.53,32.15 54.29,30.38 73.08,30.38 73.57,30.48 v73.59,30.6
EPD_BORDER  (via drill 0.3)
  Top 0.203: R16.6 59.39,40.92 59.62,41.15 59.75,41.27 62.67,41.27 Q11.3 62.69,35.15 62.69,32.61 65.08,30.22 70.64,30.22 R7.1 72.63,28.19 v71.05,28.19 | X1.3 83.41,10.07 84.77,11.43 84.77,24.38 v84.77,24.89
  Bottom 0.203: v84.77,24.89 81.59,24.89 78.29,28.19 v71.05,28.19
EPD_SO  (via drill 0.3, 0.3 pad 0.64)
  Top 0.203: U4.2 45.78,28.52 v45.04,29.23 | v81.85,26.03 79.83,26.03 X1.35
  Bottom 0.203: v45.04,29.23 46.31,30.5 48.85,30.5 49.87,31.52 52.03,31.52 53.93,29.61 75.65,29.61 80.17,29.61 80.83,28.95 81.08,28.7 81.08,26.54 v81.85,26.03
EPD_VCL
  Top 0.203: C23.2 75.52,27.4 76,26.92 78.04,24.89 78.36,24.57 X1.32
EPD_VCOM_PANEL  (via drill 0.3)
  Top 0.203: R16.3 56.45,40.89 55.56,40.89 55.56,36.95 57.21,35.3 60.76,31.75 60.76,28.19 60.76,19.81 62.16,18.41 62.16,12.21 63.06,11.31 | X1.2 X1.1 79.79,8.86 75.37,4.44 71.31,4.44 69.99,4.66 66.59,4.66 C21.2 63.94,8.51 63.46,8.31 v62.06,9.78 | 63.06,11.31 R32.1 | v63.05,11.17 63.05,11.3 63.06,11.31
  Bottom 0.203: v63.05,11.17 v62.06,9.78
EPD_VDH
  Top 0.203: Q9.3 69.04,43.2 69.12,43.2 69.15,43.18 69.27,43.3 69.27,44.07 69.65,44.45 71.18,44.45 73.08,42.54 73.08,40.76 75.12,38.73 75.62,38.22 77.45,38.22 T_VDH.T 78.92,36.95 83.75,36.95 84.77,35.94 84.77,28.95 84.77,28.19 83.88,27.3 83.37,26.67 83.37,11.94 | X1.5 77.58,11.07 | 77.58,11.07 C19.2 | 77.58,11.07 82.59,11.07 83.37,11.81 | 83.37,11.81 83.37,11.94 | 83.37,11.94 83.37,11.81 | 83.37,11.81 83.37,11.94
EPD_VDL  (via drill 0.3)
  Top 0.203: 60.54,40.28 Q11.2 | Q11.2 60.79,40.28 60.79,39.72 v61.53,38.99 | X1.4 78.45,10.57 | 78.45,10.57 76.89,9.01 76.89,8.23 C20.2 | R16.7 57.61,41.68 57.34,41.4 57.21,41.27 57.21,39.62 57.46,39.37 59.62,39.37 Q11.2 | 78.45,10.57 83.02,10.57 83.88,11.43 83.88,26.41 85.28,27.94 85.28,36.45 82.1,39.62 81.21,40.51 77.4,40.51 76.64,39.75 | 76.64,39.75 T_VDL.T | v75.12,39.88 76.51,39.88 76.64,39.75
  Bottom 0.203: v61.53,38.99 63.81,38.99 74.23,38.99 v75.12,39.88
EPD_VGH
  Top 0.203: C17.2 74.35,12.07 X1.7 81.73,12.07 81.85,12.19 82.48,12.82 82.48,28.7 81.34,28.7 81.21,28.83 81.08,28.95 79.94,30.1 78.8,30.1 77.4,31.49 77.4,35.56 76.28,36.68 T_VGH.T 70.31,42.82 Q8.3
EPD_VGL  (via drill 0.3)
  Top 0.203: v81.21,36.07 81.21,35.43 81.21,29.46 81.47,29.21 81.97,29.21 82.86,29.21 82.86,12.44 82.86,12.19 82.35,11.68 82.23,11.55 79.8,11.55 X1.6 75.92,11.57 C18.2 74.3,9.85 73.34,8.89 70.8,8.89 67.62,8.89 66.99,9.52 63.18,9.52 62.92,9.78 62.72,10.31 61.5,11.74 61.2,12.06 C16.2 | v81.21,37.84 78.85,39.37 T_VGL.T
  Top 0.61: C16.2 56.85,15.01 D5.+
  Bottom 0.203: v81.21,36.07 v81.21,37.84
GND  (via drill 0.3, 0.3 pad 0.64)
  Top 0.203: X1.38 79.78,27.56 79.05,27.56 77.02,29.59 74.35,32.26 73.72,32.26 v73.46,32.64 | X1.8 79.69,12.57 77.53,12.57 77.53,12.95 v77.43,12.98
  Top 0.305: U3.13 34.35,42.42 v33.99,42.06
  Top 0.406: U4.13 45.78,33.53 C22.1
  Bottom 0.203: v73.46,32.64 73.34,32.38
  other vias: 33.23,48.03 36.28,42.44 38.82,44.22 42.12,46.51 47.07,43.46 33.87,39.9 36.66,39.65 80.09,51.46 57.49,9.55 78.19,51.46 98.48,49.35 86.92,40.2 91.82,40.16 91.52,35.58 64.09,37.74 69.4,40.13 61.68,33.42 56.73,37.36 49.61,22.25 58.76,12.72 46.95,22.25 52.41,22.25 58.5,19.2 58.99,37.34 61.27,37.34 58.76,35.2 37.8,13.74 43.52,13.74 51.65,13.74 42.37,20.47 46.82,18.31 92.76,10.18 97.31,10.18 39.07,25.55 73.21,2.09 52.5,8.57 97.31,6.47 69.11,6.83 55.33,33.04 54.36,27.1 60.46,35.15 58.5,22.25 45.04,22.38 36.66,23.52 48.98,28.22 48.98,29.23 50.38,43.2 51.26,32.41 67.28,6.88 55.71,19.33 48.6,43.46 48.6,47.65 46.57,47.65 41.36,47.9 37.55,33.68 60.48,33.37 51.34,28.42 39.45,36.98 44.66,35.84 45.17,37.87 77.93,5.33 80.73,5.23 76.97,2.08 83.17,2.19 48.34,34.31 49.23,34.31 63.91,33.37 81.97,3.09 70.75,11.05 50.55,5.23 45.14,8.18 39.89,21.11 43.7,9.11 50.55,3.33 42.17,5.32 70.78,6.63 51.29,29.69 57.72,33.53 42.43,18.95 38.49,18.95 52.62,53.09 42.68,53.36 37.6,53.36 47.76,53.36 64.27,53.36 75.06,53.36 28.3,12.62 32,13.99 79.51,35.58 73.79,35.58 74.48,42.16 28.07,48.03 30.11,45.49 29.34,43.2 29.34,40.66 29.34,37.49 29.34,34.31 69.53,2.11 60.59,16.03 45.8,13.74 48.98,13.74 54.95,15.9 69.35,11.13 26.03,3.99 11.23,30.22 11.23,26.41 22.23,47.07 32.13,6.83 11.23,5.59 27.33,10.65 30.83,11.21 11.23,11.17 11.23,8.63
  pour Bottom (isolate 0.254): -22.8,-0.3 100.28,0.13 100.28,56.34 -22.93,55.91
  pour Top (isolate 0.254): -17.81,-0.17 100.28,0.13 100.28,56.34 -19.06,56.83
LED0
  Top 0.254: J3.1 32.87,50.59 29.9,50.59 29.6,50.29 R1.2
LED1
  Top 0.203: 37.65,50.67 37.02,51.31 37.02,54.61 34.09,54.61 33.71,54.23 33.64,54.1 | 37.65,50.29 J3.2
  Top 0.21: 37.65,50.67 37.65,50.29 J3.2
  Top 0.305: 33.64,54.1 30.54,54.1 29.27,52.83 R2.2
M_/EPD_CS  (via drill 0.3 pad 0.64)
  Top 0.305: v61.93,49.81 61.93,52.7 U$1.3
  Top 0.406: U4.12 46.41,33.04 v46.57,33.17
  Bottom 0.203: v46.57,33.17 46.69,33.04 50.63,33.04 51.77,34.19 51.77,47.88 53.7,49.81 v61.93,49.81
M_/SD_CS  (via drill 0.3 pad 0.64)
  Top 0.203: U3.12 34.98,42.11 35.59,41.5 38.36,41.5 40.09,43.71 v45.17,43.71 | v47.71,31.26 47.71,32.15 U4.10 | R20.6 43.19,26.95 v43.77,27.53
  Top 0.305: J3.5 v45.17,50.82
  Bottom 0.203: v45.17,50.82 v45.17,43.71 45.17,40.28 43.77,38.88 43.77,31.26 | v43.77,27.53 43.77,31.26 | v47.71,31.26 43.77,31.26
M_/WORD_STOCK_CS  (via drill 0.3 pad 0.64)
  Top 0.203: v47.07,28.09 U4.4 47.07,25.42 46.82,25.17 44.66,25.17 44.41,25.42 44.41,27.71 44.15,28.22 43.01,28.22 42.37,27.71 R20.7 | 50.5,37.36 50.38,37.49 | D4.- 49.61,37.11 49.61,35.58 50.5,34.69 50.5,27.2 v50.76,26.95 | v58,49.17 58.86,49.17 59.39,49.17
  Top 0.305: v53.8,37.49 50.38,37.49 D4.- | U$1.2 59.37,49.68 58.86,49.17
  Bottom 0.203: v58,49.17 54.44,49.17 53.8,48.54 v53.8,37.49 | v50.76,26.95 49.11,26.95 47.96,28.09 v47.07,28.09
M_EPD_/RESET  (via drill 0.3 pad 0.64)
  Top 0.203: U3.9 36.94,44.45 36.53,44.85 R4.1 37.29,46.38 38.69,46.38 41.1,44.35 v50.25,44.35
  Top 0.305: J3.7 v50.25,50.82
  Bottom 0.203: v50.25,44.35 v50.25,50.82
M_EPD_BORDER
  Top 0.203: R36.1 43.77,46.25 42.63,47.39 J3.4
M_EPD_BUSY  (via drill 0.3, 0.3 pad 0.64)
  Top 0.203: v81.85,28.06 v81.84,28.07 X1.39
  Top 0.305: J3.8 v52.79,47.9
  Bottom 0.203: v52.79,47.9 52.15,47.27 52.15,31.95 54.08,29.99 75.39,29.99 80.42,29.99 81.34,29.08 81.85,28.57 v81.85,28.06
M_EPD_DISCHARGE
  Top 0.305: R42.2 63.58,46.38 62.31,47.65 57.87,47.65 56.85,48.66 56.85,52.7 U$1.1
M_EPD_PANEL_ON  (via drill 0.3, 0.3 pad 0.64)
  Top 0.203: J3.3 39.96,52.6 39.96,47.39 41.87,45.49 48.09,45.49 48.19,45.59 v50.98,45.59
  Top 0.305: R27.1 v64.09,36.09 | v53.83,36.09 v51.14,36.09
  Bottom 0.203: v51.14,36.09 51.39,36.34 51.39,44.98 51.39,45.18 v50.98,45.59
  Bottom 0.305: v64.09,36.09 v53.83,36.09
M_EPD_PWM  (via drill 0.3)
  Top 0.203: J3.6 46.79,49.27 v44.38,49.27 | v42.6,22.35 44.53,20.67 R29.2 44.66,16.79 Q7.1
  Top 0.406: Q7.1 46.18,17.04 49.49,17.04 R26.2
  Bottom 0.203: v44.38,49.27 44.25,49.15 44.25,43.3 44.25,41.53 42.48,39.88 42.48,32.38 v42.6,22.35
M_MISO
  Top 0.305: R12.6 39.71,31.52 | 39.71,31.52 39.45,31.52 | 39.45,31.52 39.2,31.52 | 39.2,31.52 36.66,31.52 | R12.8 39.63,29.94 39.45,30.12 39.45,30.5 | 39.45,30.5 39.45,30.76 | 39.45,30.76 39.45,31.01 | 39.45,31.01 39.45,31.26 | 39.45,31.26 39.45,31.52 | R12.7 39.71,30.76 | 39.71,30.76 39.45,30.76 | 39.71,31.52 39.45,31.26 | 39.45,31.26 39.2,31.52 | 39.45,31.01 39.71,30.76 | 39.71,30.76 39.45,30.5
  Top 0.61: 36.66,31.52 J7.6
M_MOSI
  Top 0.305: U3.2 34.35,35.81 R3.1 | R3.1 34.12,35.46 | J7.2 33.1,28.6 33.41,28.93 33.41,32.48 34.98,34.06 34.98,34.72 R3.1
M_SCK
  Top 0.305: U3.5 36.28,35.84 R37.1 35.64,34.69 35.64,33.8 34.07,32.23 34.07,28.9 34.37,28.6 J7.5
M_TEMP_SEN  (via drill 0.3)
  Top 0.254: U9.4 55.79,28.65 R23.2 C56.2
  Top 0.406: J5.1 48.83,3.05 v48.83,8.13 | v56.95,27.43 57.02,27.5 U9.4
  Bottom 0.406: v48.83,8.13 56.95,16.25 v56.95,27.43
M_VCC_3V3
  Top 0.203: 89.59,45.08 R6.1 | 93.15,45.08 R15.1 | R5.1 86.04,45.08 89.47,45.08 R6.1 | R15.1 93.28,45.08 96.7,45.08 R17.1 | 93.15,45.08 90.27,45.08 | 90.27,45.08 89.59,45.08 | 89.59,45.08 R6.1 | 93.15,45.08 R15.1 | 90.27,3.46 90.27,45.08 | 84.64,2.66 83.24,4.06 66.23,4.06 65.59,4.7 63.56,4.7 J6.5 | 90.27,45.08 R6.1
  Top 0.254: 90.27,3.46 89.2,2.69 86.1,2.69 86.08,2.66 84.64,2.66
  Top 0.61: Q5.3 58.33,11.07 62.03,7.36 63.3,6.09 63.3,4.82 J6.5
M_VCC_5V
  Top 0.61: J6.4 60.38,1.95 60.38,4.82 60.38,6.09 58.99,7.49 50.98,7.49 51.01,7.52 R14.2
  Top 0.813: R19.1 R14.2 D3.+
N$1  (via drill 0.3)
  Top 0.203: v33.71,52.7 32.95,53.46 30.54,53.46 30.54,53.34 28.38,51.18 26.98,51.18 26.98,50.29 R1.1
  Bottom 0.203: v33.71,52.7 43.49,52.7 45.02,54.23 LED0.A
N$2
  Top 0.61: Q5.1 52.66,11.96 R19.2
N$3
  Top 0.61: D5.- D6.+ 52.53,17.55 C15.2
N$4
  Top 0.61: Q7.2 46.18,15.14 R29.1 R30.1 41.74,15.14 D7.- 40.72,14.12
N$6
  Top 0.203: R27.2 R28.2 70.06,37.61 Q2.1
N$7
  Top 0.305: U3.11 35.64,44.85 R11.1
N$8
  Top 0.406: U2.3 44.41,11.45 D3.- 46.57,11.07 C30.2
N$9
  Top 0.406: R26.1 48.98,15.14 Q7.3
  Top 0.61: C15.1 49.99,15.01 R26.1
N$10
  Top 0.203: R42.1 R39.2 67.9,44.22 68.03,44.09 68.16,44.09 | 68.16,44.09 Q8.1 | Q9.1 64.47,44.47 68.03,44.47 68.16,44.35 68.16,44.09
N$11
  Top 0.203: R25.2 68.16,33.93 Q3.1 70.44,33.93 72.22,35.71 Q2.3
N$12
  Top 0.203: R32.2 R31.1
N$13
  Top 0.203: 56.52,42.52 R16.1 57.16,43.2 62.06,43.2 62.69,43.84 Q10.3
N$14
  Top 0.305: R36.2 60.41,46.25 arc-90 Q10.1
N$16
  Top 0.203: R18.2 64.73,42.06 | 64.73,42.06 64.73,42.31 Q9.2 | Q8.2 68.28,41.93 67.77,41.93 67.65,41.81 64.85,41.81 64.85,41.93 64.73,42.06
N$17  (via drill 0.3)
  Top 0.203: v52.64,54.23 51.24,54.23 50.48,54.99 26.98,54.99 26.98,52.83 R2.1
  Bottom 0.203: v52.64,54.23 LED1.A
N$20
  Top 0.203: U4.3 46.41,29 45.55,29.87 42.17,29.87 R12.1
N$21
  Top 0.203: 42.25,30.63 R12.2 42.88,30.76 43.39,30.25 45.83,30.25 48.37,27.71 U4.6 48.34,26.34
N$22
  Top 0.203: U4.8 49.08,31.11 48.6,30.63 43.64,30.63 42.76,31.52 R12.3
N$27
  Top 0.203: U4.11 47.07,31.26 46.95,31.14 43.9,31.14 42.68,32.36 R12.4
N$28
  Top 0.203: Q11.1 60.33,42.52 R16.8 57.54,42.52 56.73,41.68 R16.2
N$34
  Top 0.203: X1.31 78.22,24.07 75.29,26.92 72.75,26.92 72.7,26.41 72.7,25.63 C34.1
N$35
  Top 0.203: C34.2 75.57,25.7 76.51,24.89 77.96,23.57 X1.30
N$36
  Top 0.203: X1.29 77.78,23.11 75.88,24.76 70.16,24.76 69.4,25.14 65.74,25.14 C39.1
N$37
  Top 0.203: X1.28 77.69,22.57 76.26,23.87 75.88,24.25 64.85,24.25 C39.2
N$74
  Top 0.305: U3.3 34.98,39.04 37.02,41.04 39.45,41.04 arc90 R8.1
N$76
  Top 0.305: R10.1 37.55,39.39 36.94,38.81 U3.6
N$80
  Top 0.305: U3.8 37.65,45.08 R9.1
N$81
  Top 0.203: X1.27 77.56,22.07 77.53,22.1 75.62,23.87 72.58,23.87 72.52,23.82 C35.1
N$85
  Top 0.203: X1.26 77.29,21.57 75.62,23.24 74.63,23.24 C35.2
N$88
  Top 0.203: X1.25 77.16,21.07 76.39,21.84 70.42,21.84 69.53,22.73 66.12,22.73 C32.1
N$89
  Top 0.203: X1.24 77.02,20.57 76.26,21.33 69.53,21.33 69.02,21.84 65.23,21.84 C32.2
N$90
  Top 0.203: X1.23 76.76,20.07 76.13,20.7 74.76,20.7 C37.1
N$91  (via drill 0.3)
  Top 0.203: X1.22 76.12,19.57 v75.75,19.94 | v70.92,20.44 72.32,20.44 C37.2
  Bottom 0.203: v75.75,19.94 71.43,19.94 v70.92,20.44
N$92
  Top 0.203: X1.21 75.6,19.07 75.5,19.17 69.91,19.17 69.02,20.06 68.41,20.67 C10.1
N$93
  Top 0.203: X1.20 75.47,18.57 75.24,18.79 69.27,18.79 68.51,19.56 64.32,19.56 64.07,19.81 C10.2
N$94
  Top 0.203: X1.19 74.67,18.07 C11.1
N$95  (via drill 0.3)
  Top 0.203: X1.18 76.56,17.57 v76.26,17.27 | v70.8,18.16 72.07,18.16 C11.2
  Bottom 0.203: v76.26,17.27 76.26,17.4 75.5,18.16 v70.8,18.16
N$96  (via drill 0.3)
  Top 0.203: X1.17 81.26,17.07 v81.72,17.52 | v68.51,18.16 65.95,18.16 C12.1
  Bottom 0.203: v81.72,17.52 78.42,17.52 77.91,17.02 77.4,16.51 70.16,16.51 v68.51,18.16
N$97  (via drill 0.3)
  Top 0.203: X1.16 81.28,16.57 v81.59,16.25 | v68.64,16 67.88,16.76 65.84,16.76 64.57,16.76 64.07,17.27 C12.2
  Bottom 0.203: v81.59,16.25 77.91,16.25 77.66,16 v68.64,16
N$98
  Top 0.203: X1.15 74.7,16.07 C13.1
N$99
  Top 0.203: X1.14 76.08,15.57 75.42,14.86 75.24,14.68 73.26,14.68 C13.2
N$100
  Top 0.203: X1.13 76.45,15.07 75.62,14.3 68.77,14.3 67.37,15.75 65.56,15.75 C14.1
N$101
  Top 0.203: X1.12 76.73,14.57 76.26,14.09 76,13.84 73.59,13.84 66,13.84 arc-90 C14.2
S_MOSI  (via drill 0.3)
  Top 0.203: 30.21,15.64 J2.3 31.92,15.6 v31.93,15.62 | X1.36 78.77,26.57 74.48,30.86 74.1,31.24 72.7,31.24 v72.45,30.99 | v53.14,41.53 50.48,41.53 49.72,42.29 46.41,42.29 45.65,43.05 44.51,43.05 41.33,43.05 41.23,42.95 R8.2 | U5.6 43.46,41.3 R8.2 | R8.2 40.57,40.64 v40.57,40.38 | v40.06,23.75 34.98,18.79 v32.19,18.79
  Bottom 0.203: v72.45,30.99 72.32,30.86 64.83,30.86 61.65,30.86 54.41,30.86 53.02,32.26 53.02,41.4 v53.14,41.53 | v40.57,40.38 41.08,39.37 41.08,37.34 41.08,24.89 v40.06,23.75 | v32.19,18.79 31.93,18.54 v31.93,15.62
S_SCK  (via drill 0.3)
  Top 0.203: X1.37 78.91,27.07 76.51,29.46 74.35,31.62 74.23,31.75 v72.32,31.75 | v53.65,35.18 v50.86,35.18 | v45.78,36.19 43.58,38.39 U5.1 43.33,39.39 R10.2 41.84,38.78 v41.84,37.84 | v41.08,23.62 38.16,20.7 35.26,17.8 J2.5
  Bottom 0.203: v72.32,31.75 71.94,31.75 71.43,31.24 70.54,31.24 63.69,31.24 54.8,31.24 53.52,32.51 53.52,35.05 v53.65,35.18 | v50.86,35.18 46.79,35.18 v45.78,36.19 | v41.84,37.84 41.84,30.22 41.84,24.76 v41.08,23.62
SD_DO
  Top 0.203: J2.7 34.92,20 39.3,24.38 39.68,24.76 42.73,24.76 43.24,24.25 49.97,24.25 49.97,33.27 48.45,33.27 48.37,33.2 U4.9
VCC_3V3  (via drill 0.3, 0.3 pad 0.64)
  Top 0.203: 45.47,41.83 U5.4 45.42,41.5 | 47.58,41.17 C42.2 | Q3.2 70.31,32.15 71.2,33.04 71.2,33.8 71.71,34.31 | 52.41,25.68 50.98,24.51 50.98,23.62 42.73,23.62 40.85,21.74 D7.+
  Top 0.254: 71.71,34.31 T_3V3.T
  Top 0.305: 56.5,34.31 C47.2 | C43.2 58.25,44.47 60.28,44.47 60.54,44.22 Q10.2 | R13.2 49.23,39.77 54.44,39.77 | 54.44,39.77 54.69,39.77 | 54.44,39.77 54.69,40.03 | 54.44,39.77 54.69,39.52 | R13.2 49.11,39.52 47.84,38.25 47.84,36.22 47.2,35.58 46.18,35.58 44.91,34.31 | R13.2 49.11,39.77 C42.2 | 45.42,41.5 45.42,42.31 45.17,42.57 42.63,42.57 v42.25,42.19 | 40.98,16.66 40.98,17.42 D7.+
  Top 0.406: U4.14 45.07,34.29 C22.2 44.91,34.31 R24.1 | U3.14 33.64,45.21 C40.2 32.34,45.62 31.83,46.12 31.83,48.16 32.59,49.04 35.64,49.04 v36.53,48.03 R4.2 | U5.4 47.45,41.42 C42.2 | Q3.2 70.06,32.28 R25.1 C41.2 66.1,32.26 v64.7,32.26 | R22.1 C48.2 54.24,24.03 52.71,25.55 C46.2 52.41,25.68 52.41,31.72 52.41,32.23 56.58,32.25 | C29.+ 35.14,12.93 | 35.14,12.93 36.46,12.93 R40.1 | C28.2 35.26,13.05 35.14,12.93 | J2.4 30.21,16.66 C44.2 33.54,16.66 35.06,15.14 C28.2 | C28.2 35.52,15.14 37.04,16.66 C45.2 C49.2 40.98,16.66 R30.2 | C43.2 56.85,43.58 55.46,43.58 54.69,42.82 54.69,40.03 54.69,39.77 54.69,39.52 54.69,36.47 56.73,34.44 C47.2 56.73,32.4 56.58,32.25 | 56.58,32.25 57.45,32.25 v57.46,32.26
  Bottom 0.305: v42.25,42.19 38.44,42.19 36.53,44.09 v36.53,48.03
  Bottom 0.406: v57.46,32.26 v64.7,32.26
VCC_3V3_EPD  (via drill 0.3)
  Top 0.203: X1.10 X1.9 | 80.43,13.57 80.45,13.59 80.45,13.57
  Top 0.305: C51.2 C50.2 | X1.10 80.45,13.57 81.45,13.57 arc90 v81.47,13.59
  Top 0.406: 72.25,33.02 Q3.3 72.73,33.55 v74.35,33.55 75.5,31.77 T_E3V3.T | v83.8,5.49 85.66,3.81 86.04,3.43 C51.2 89.2,4.23 v89.2,4.69 | v91.4,29.89 91.6,29.59 91.6,13.09 91.6,5.89 v91.6,5.79
  Bottom 0.406: v74.35,33.55 74.35,32.92 74.35,31.75 75.5,30.6 80.07,30.6 80.45,30.6 81.13,31.45 81.17,31.59 89.1,31.59 v91.4,29.89 | v83.8,5.49 81.47,7.83 v81.47,13.59 | v89.2,4.69 90.6,4.79 v91.6,5.79
VCC_OUT  (via drill 0.38 pad 0.81)
  Top 0.61: R40.2 37.29,10.56 C54.1 | Q5.2 v54.19,8.91 | C54.1 U2.2 | C54.1 39.71,9.55 v40.34,8.91
  Bottom 0.61: v40.34,8.91 42.65,6.6 53.14,6.6 54.19,7.64 v54.19,8.91
VCOM_DRIVER
  Top 0.203: X1.11 76.87,14.07 76.64,13.84 76.13,13.33 75.37,13.33 67.11,13.33 66.48,12.95 64.83,12.95 64.19,12.34 R31.2
VDD
  Top 0.305: R22.2 56.47,25.68 C55.1 58.99,25.96 U9.1
WS_DO  (via drill 0.3 pad 0.64)
  Top 0.203: U5.5 v44.15,40.28 | U4.5 v47.71,27.2
  Bottom 0.203: v47.71,27.2 47.45,26.95 43.42,26.95 43.06,27.33 43.06,39.06 v44.15,40.28

### Text on the board
tPlace: D7 | D0 | D8 | GND | NC | MISO | MOSI | SCK | NC | GND | GND | 5V | RESET | A0 | A5 | VIN | GND | 3V3
bPlace: Small e-Paper Shield | version dOry 22/05/2015 | by seeedstudio | www.seeedstudio.com | edited by dOry